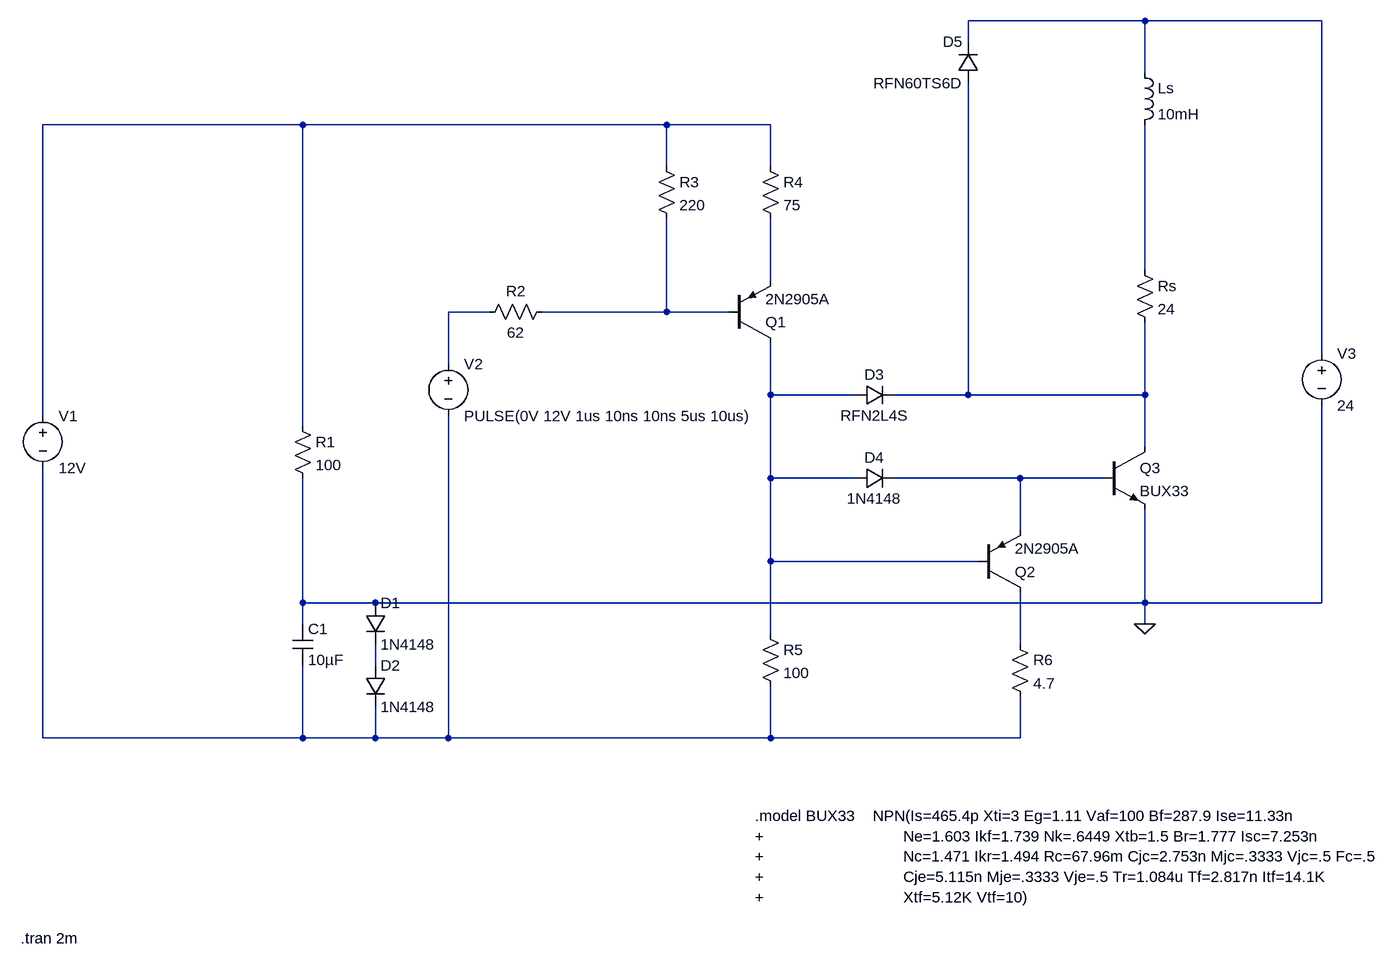
[diagram p0: schematic Draft1.asc]
Draft1.asc, the LTspice schematic file:
Version 4
SHEET 1 1880 1076
WIRE 1120 -352 848 -352
WIRE 1392 -352 1120 -352
WIRE 848 -320 848 -352
WIRE 1120 -272 1120 -352
WIRE -176 -192 -576 -192
WIRE 384 -192 -176 -192
WIRE 544 -192 384 -192
WIRE 384 -128 384 -192
WIRE 544 -128 544 -192
WIRE 1120 32 1120 -192
WIRE 544 48 544 -48
WIRE 112 96 48 96
WIRE 384 96 384 -48
WIRE 384 96 192 96
WIRE 480 96 384 96
WIRE 1392 160 1392 -352
WIRE 48 176 48 96
WIRE 544 224 544 144
WIRE 672 224 544 224
WIRE 848 224 848 -256
WIRE 848 224 736 224
WIRE 1120 224 1120 112
WIRE 1120 224 848 224
WIRE -576 256 -576 -192
WIRE -176 272 -176 -192
WIRE 1120 304 1120 224
WIRE 544 352 544 224
WIRE 672 352 544 352
WIRE 928 352 736 352
WIRE 1056 352 928 352
WIRE 928 432 928 352
WIRE 544 480 544 352
WIRE 864 480 544 480
WIRE -176 544 -176 352
WIRE -64 544 -176 544
WIRE 1120 544 1120 400
WIRE 1120 544 -64 544
WIRE 1392 544 1392 240
WIRE 1392 544 1120 544
WIRE -176 576 -176 544
WIRE 1120 576 1120 544
WIRE 544 592 544 480
WIRE 928 608 928 528
WIRE -64 640 -64 608
WIRE -576 752 -576 336
WIRE -176 752 -176 640
WIRE -176 752 -576 752
WIRE -64 752 -64 704
WIRE -64 752 -176 752
WIRE 48 752 48 256
WIRE 48 752 -64 752
WIRE 544 752 544 672
WIRE 544 752 48 752
WIRE 928 752 928 688
WIRE 928 752 544 752
FLAG 1120 576 0
SYMBOL voltage -576 240 R0
WINDOW 123 0 0 Left 0
WINDOW 39 0 0 Left 0
SYMATTR InstName V1
SYMATTR Value 12V
SYMBOL res -192 256 R0
SYMATTR InstName R1
SYMATTR Value 100
SYMBOL res 96 112 R270
WINDOW 0 32 56 VTop 2
WINDOW 3 0 56 VBottom 2
SYMATTR InstName R2
SYMATTR Value 62
SYMBOL res 368 -144 R0
SYMATTR InstName R3
SYMATTR Value 220
SYMBOL res 528 -144 R0
SYMATTR InstName R4
SYMATTR Value 75
SYMBOL pnp 480 144 M180
SYMATTR InstName Q1
SYMATTR Value 2N2905A
SYMBOL voltage 48 160 R0
WINDOW 123 0 0 Left 0
WINDOW 39 0 0 Left 0
SYMATTR InstName V2
SYMATTR Value PULSE(0V 12V 1us 10ns 10ns 5us 10us)
SYMBOL cap -192 576 R0
SYMATTR InstName C1
SYMATTR Value 10µF
SYMBOL diode -80 544 R0
SYMATTR InstName D1
SYMATTR Value 1N4148
SYMBOL diode -80 640 R0
SYMATTR InstName D2
SYMATTR Value 1N4148
SYMBOL diode 672 240 R270
WINDOW 0 32 32 VTop 2
WINDOW 3 0 32 VBottom 2
SYMATTR InstName D3
SYMATTR Value RFN2L4S
SYMBOL diode 672 368 R270
WINDOW 0 32 32 VTop 2
WINDOW 3 0 32 VBottom 2
SYMATTR InstName D4
SYMATTR Value 1N4148
SYMBOL res 528 576 R0
SYMATTR InstName R5
SYMATTR Value 100
SYMBOL pnp 864 528 M180
SYMATTR InstName Q2
SYMATTR Value 2N2905A
SYMBOL res 912 592 R0
SYMATTR InstName R6
SYMATTR Value 4.7
SYMBOL npn 1056 304 R0
SYMATTR InstName Q3
SYMATTR Value BUX33
SYMBOL res 1104 16 R0
SYMATTR InstName Rs
SYMATTR Value 24
SYMBOL diode 864 -256 R180
WINDOW 0 24 64 Left 2
WINDOW 3 24 0 Left 2
SYMATTR InstName D5
SYMATTR Value RFN60TS6D
SYMBOL ind 1104 -288 R0
SYMATTR InstName Ls
SYMATTR Value 10mH
SYMBOL voltage 1392 144 R0
WINDOW 123 0 0 Left 0
WINDOW 39 0 0 Left 0
SYMATTR InstName V3
SYMATTR Value 24
TEXT 520 872 Left 2 !.model BUX33    NPN(Is=465.4p Xti=3 Eg=1.11 Vaf=100 Bf=287.9 Ise=11.33n\n+                               Ne=1.603 Ikf=1.739 Nk=.6449 Xtb=1.5 Br=1.777 Isc=7.253n\n+                               Nc=1.471 Ikr=1.494 Rc=67.96m Cjc=2.753n Mjc=.3333 Vjc=.5 Fc=.5\n+                               Cje=5.115n Mje=.3333 Vje=.5 Tr=1.084u Tf=2.817n Itf=14.1K\n+                               Xtf=5.12K Vtf=10)
TEXT -610 1060 Left 2 !.tran 2m

The netlist it stands for:
* Draft1.asc
V1 N002 N012 12V
R1 N002 0 100
R2 N005 N006 62
R3 N002 N006 220
R4 N002 N004 75
Q1 N007 N006 N004 0 2N2905A
V2 N005 N012 PULSE(0V 12V 1us 10ns 10ns 5us 10us)
C1 0 N012 10µF
D1 0 N011 1N4148
D2 N011 N012 1N4148
D3 N007 N008 RFN2L4S
D4 N007 N009 1N4148
R5 N007 N012 100
Q2 N010 N007 N009 0 2N2905A
R6 N010 N012 4.7
Q3 N008 N009 0 0 BUX33
Rs N003 N008 24
D5 N008 N001 RFN60TS6D
Ls N001 N003 10mH
V3 N001 0 24
.model D D
.lib standard.dio
.model NPN NPN
.model PNP PNP
.lib standard.bjt
.model BUX33    NPN(Is=465.4p Xti=3 Eg=1.11 Vaf=100 Bf=287.9 Ise=11.33n
+                               Ne=1.603 Ikf=1.739 Nk=.6449 Xtb=1.5 Br=1.777 Isc=7.253n
+                               Nc=1.471 Ikr=1.494 Rc=67.96m Cjc=2.753n Mjc=.3333 Vjc=.5 Fc=.5
+                               Cje=5.115n Mje=.3333 Vje=.5 Tr=1.084u Tf=2.817n Itf=14.1K
+                               Xtf=5.12K Vtf=10)
.tran 2m
.backanno
.end